# EAGLE schematic DuinoProto (EAGLE 5.04)
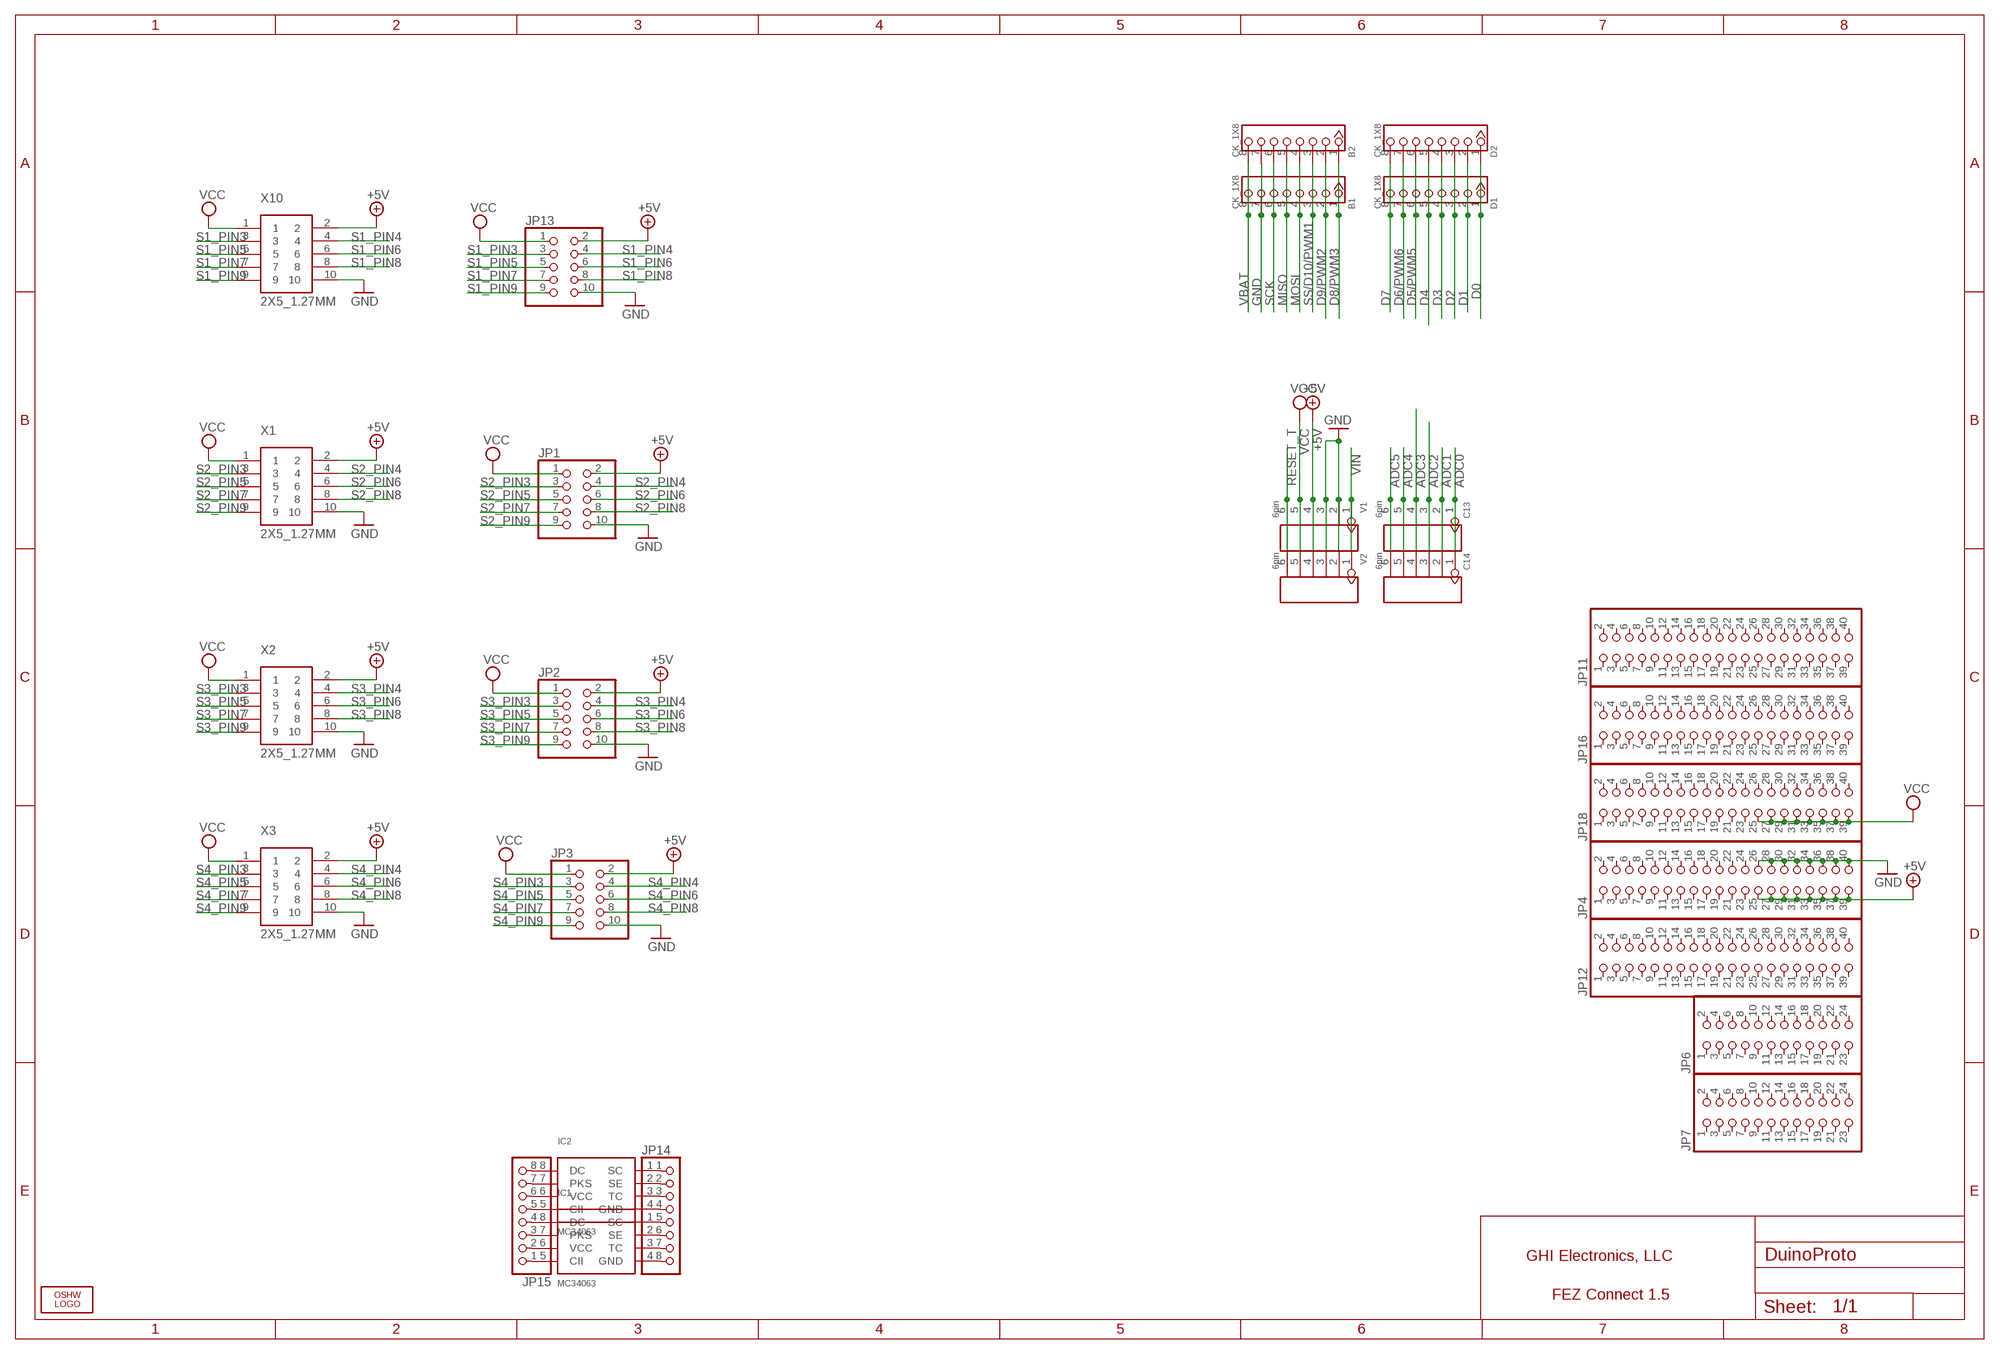
[diagram p0: schematic, sheet 1]

## Parts
B1  CK_1X8  CK_1X8DD  [CK_1X8]
B2  CK_1X8  CK_1X8DD  [CK_1X8]
C13  6pin  CK_16  [CK_1*6]
C14  6pin  CK_16  [CK_1*6]
D1  CK_1X8  CK_1X8DD  [CK_1X8]
D2  CK_1X8  CK_1X8DD  [CK_1X8]
IC1  MC34063  [SO8]
IC2  MC34063  [SO8]
JP1  PINHD-2X5  [2X05]
JP2  PINHD-2X5  [2X05]
JP3  PINHD-2X5  [2X05]
JP4  PINHD-2X20  [2X20]
JP6  PINHD-2X12  [2X12]
JP7  PINHD-2X12  [2X12]
JP11  PINHD-2X20  [2X20]
JP12  PINHD-2X20  [2X20]
JP13  PINHD-2X5  [2X05]
JP14  PINHD-1X8  [1X08]
JP15  PINHD-1X8  [1X08]
JP16  PINHD-2X20  [2X20]
JP18  PINHD-2X20  [2X20]
LOGO2  LOGO-OSHW-FILLX0200-NT  [OSHW_FILLX200_NOTEXT]
V1  6pin  CK_16  [CK_1*6]
V2  6pin  CK_16  [CK_1*6]
X1  2X5_1.27MM  [2X5_1.27MM]
X2  2X5_1.27MM  [2X5_1.27MM]
X3  2X5_1.27MM  [2X5_1.27MM]
X10  2X5_1.27MM  [2X5_1.27MM]

## Nets
+5V: JP1.2 JP2.2 JP3.2 JP4.25 JP4.27 JP4.29 JP4.31 JP4.33 JP4.35 JP4.37 JP4.39 JP13.2 V1.4 V2.4 X1.2 X2.2 X3.2 X10.2
ADC0: C13.1 C14.1
ADC1: C13.2 C14.2
ADC2: C13.3 C14.3
ADC3: C13.4 C14.4
ADC4: C13.5 C14.5
ADC5: C13.6 C14.6
D0: D1.1 D2.1
D1: D1.2 D2.2
D2: D1.3 D2.3
D3: D1.4 D2.4
D4: D1.5 D2.5
D5/PWM5: D1.6 D2.6
D6/PWM6: D1.7 D2.7
D7: D1.8 D2.8
D8/PWM3: B1.1 B2.1
D9/PWM2: B1.2 B2.2
GND [power]: B1.7 B2.7 JP1.10 JP2.10 JP3.10 JP4.26 JP4.28 JP4.30 JP4.32 JP4.34 JP4.36 JP4.38 JP4.40 JP13.10 V1.2 V1.3 V2.2 V2.3 X1.10 X2.10 X3.10 X10.10
MISO: B1.5 B2.5
MOSI: B1.4 B2.4
N$1: IC2.1(SC) JP14.1
N$2: IC2.2(SE) JP14.2
N$3: IC2.3(TC) JP14.3
N$4: IC2.4(GND) JP14.4
N$5: IC2.5(CII) JP15.5
N$6: IC2.6(VCC) JP15.6
N$7: IC2.7(PKS) JP15.7
N$8: IC2.8(DC) JP15.8
N$9: IC1.4(GND) JP14.8
N$10: IC1.3(TC) JP14.7
N$11: IC1.2(SE) JP14.6
N$12: IC1.1(SC) JP14.5
N$13: IC1.8(DC) JP15.4
N$14: IC1.7(PKS) JP15.3
N$15: IC1.6(VCC) JP15.2
N$16: IC1.5(CII) JP15.1
RESET_T: V1.6 V2.6
S1_PIN3: JP13.3 X10.3
S1_PIN4: JP13.4 X10.4
S1_PIN5: JP13.5 X10.5
S1_PIN6: JP13.6 X10.6
S1_PIN7: JP13.7 X10.7
S1_PIN8: JP13.8 X10.8
S1_PIN9: JP13.9 X10.9
S2_PIN3: JP1.3 X1.3
S2_PIN4: JP1.4 X1.4
S2_PIN5: JP1.5 X1.5
S2_PIN6: JP1.6 X1.6
S2_PIN7: JP1.7 X1.7
S2_PIN8: JP1.8 X1.8
S2_PIN9: JP1.9 X1.9
S3_PIN3: JP2.3 X2.3
S3_PIN4: JP2.4 X2.4
S3_PIN5: JP2.5 X2.5
S3_PIN6: JP2.6 X2.6
S3_PIN7: JP2.7 X2.7
S3_PIN8: JP2.8 X2.8
S3_PIN9: JP2.9 X2.9
S4_PIN3: JP3.3 X3.3
S4_PIN4: JP3.4 X3.4
S4_PIN5: JP3.5 X3.5
S4_PIN6: JP3.6 X3.6
S4_PIN7: JP3.7 X3.7
S4_PIN8: JP3.8 X3.8
S4_PIN9: JP3.9 X3.9
SCK: B1.6 B2.6
SS/D10/PWM1: B1.3 B2.3
VBAT: B1.8 B2.8
VCC [power]: JP1.1 JP2.1 JP3.1 JP13.1 JP18.25 JP18.27 JP18.29 JP18.31 JP18.33 JP18.35 JP18.37 JP18.39 V1.5 V2.5 X1.1 X2.1 X3.1 X10.1
VIN: V1.1 V2.1
Unconnected: JP4.1 JP4.2 JP4.3 JP4.4 JP4.5 JP4.6 JP4.7 JP4.8 JP4.9 JP4.10 JP4.11 JP4.12 JP4.13 JP4.14 JP4.15 JP4.16 JP4.17 JP4.18 JP4.19 JP4.20 JP4.21 JP4.22 JP4.23 JP4.24 JP6.1 JP6.2 JP6.3 JP6.4 JP6.5 JP6.6 JP6.7 JP6.8 JP6.9 JP6.10 JP6.11 JP6.12 JP6.13 JP6.14 JP6.15 JP6.16 JP6.17 JP6.18 JP6.19 JP6.20 JP6.21 JP6.22 JP6.23 JP6.24 JP7.1 JP7.2 JP7.3 JP7.4 JP7.5 JP7.6 JP7.7 JP7.8 JP7.9 JP7.10 JP7.11 JP7.12 JP7.13 JP7.14 JP7.15 JP7.16 JP7.17 JP7.18 JP7.19 JP7.20 JP7.21 JP7.22 JP7.23 JP7.24 JP11.1 JP11.2 JP11.3 JP11.4 JP11.5 JP11.6 JP11.7 JP11.8 JP11.9 JP11.10 JP11.11 JP11.12 JP11.13 JP11.14 JP11.15 JP11.16 JP11.17 JP11.18 JP11.19 JP11.20 JP11.21 JP11.22 JP11.23 JP11.24 JP11.25 JP11.26 JP11.27 JP11.28 JP11.29 JP11.30 JP11.31 JP11.32 JP11.33 JP11.34 JP11.35 JP11.36 JP11.37 JP11.38 JP11.39 JP11.40 JP12.1 JP12.2 JP12.3 JP12.4 JP12.5 JP12.6 JP12.7 JP12.8 JP12.9 JP12.10 JP12.11 JP12.12 JP12.13 JP12.14 JP12.15 JP12.16 JP12.17 JP12.18 JP12.19 JP12.20 JP12.21 JP12.22 JP12.23 JP12.24 JP12.25 JP12.26 JP12.27 JP12.28 JP12.29 JP12.30 JP12.31 JP12.32 JP12.33 JP12.34 JP12.35 JP12.36 JP12.37 JP12.38 JP12.39 JP12.40 JP16.1 JP16.2 JP16.3 JP16.4 JP16.5 JP16.6 JP16.7 JP16.8 JP16.9 JP16.10 JP16.11 JP16.12 JP16.13 JP16.14 JP16.15 JP16.16 JP16.17 JP16.18 JP16.19 JP16.20 JP16.21 JP16.22 JP16.23 JP16.24 JP16.25 JP16.26 JP16.27 JP16.28 JP16.29 JP16.30 JP16.31 JP16.32 JP16.33 JP16.34 JP16.35 JP16.36 JP16.37 JP16.38 JP16.39 JP16.40 JP18.1 JP18.2 JP18.3 JP18.4 JP18.5 JP18.6 JP18.7 JP18.8 JP18.9 JP18.10 JP18.11 JP18.12 JP18.13 JP18.14 JP18.15 JP18.16 JP18.17 JP18.18 JP18.19 JP18.20 JP18.21 JP18.22 JP18.23 JP18.24 JP18.26 JP18.28 JP18.30 JP18.32 JP18.34 JP18.36 JP18.38 JP18.40

## Notes on the sheet
- Optional 3.3V
- GHI Electronics, LLC
- FEZ Connect 1.5

## Library data of the parts
B1 B2 D1 D2 = CONNECTER:CK_1X8
C13 C14 V1 V2 = CONNECTER:CK_1*6
IC1 IC2 = GHI:MC34063
JP1-JP3 JP13 = pinhead:PINHD-2X5: PIN HEADER
JP4 JP11 JP12 JP16 JP18 = pinhead:PINHD-2X20: PIN HEADER
JP6 JP7 = pinhead:PINHD-2X12: PIN HEADER
JP14 JP15 = pinhead:PINHD-1X8: PIN HEADER
LOGO2 = Logo:LOGO-OSHW-FILL
X1-X3 X10 = GHI:2X5_1.27MM